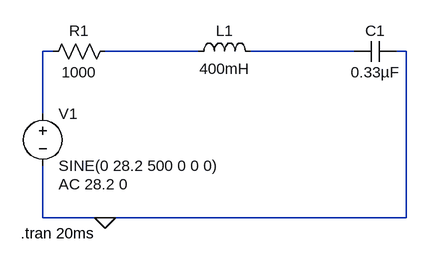
[diagram p0: schematic sinusoidal.asc]
sinusoidal.asc, the LTspice schematic file:
Version 4
SHEET 1 880 680
WIRE 48 144 32 144
WIRE 272 144 128 144
WIRE 512 144 352 144
WIRE 592 144 576 144
WIRE 32 240 32 144
WIRE 32 400 32 320
WIRE 128 400 32 400
WIRE 592 400 592 144
WIRE 592 400 128 400
FLAG 128 400 0
SYMBOL res 144 128 R90
WINDOW 0 0 56 VBottom 2
WINDOW 3 32 56 VTop 2
SYMATTR InstName R1
SYMATTR Value 1000
SYMBOL ind 256 160 R270
WINDOW 0 32 56 VTop 2
WINDOW 3 5 56 VBottom 2
SYMATTR InstName L1
SYMATTR Value 400mH
SYMBOL cap 576 128 R90
WINDOW 0 0 32 VBottom 2
WINDOW 3 32 32 VTop 2
SYMATTR InstName C1
SYMATTR Value 0.33µF
SYMBOL voltage 32 224 R0
WINDOW 123 24 124 Left 2
WINDOW 39 0 0 Left 0
SYMATTR InstName V1
SYMATTR Value SINE(0 28.2 500 0 0 0)
SYMATTR Value2 AC 28.2 0
TEXT -2 424 Left 2 !.tran 20ms

The netlist it stands for:
* sinusoidal.asc
R1 N002 N001 1000
L1 N002 N003 400mH
C1 0 N003 0.33µF
V1 N001 0 SINE(0 28.2 500 0 0 0) AC 28.2 0
.tran 20ms
.backanno
.end